# EAGLE schematic M6RF-315 (EAGLE 6.0)
DESIGNER: Sandor Szilvasi; PAGE1: Cover Page; PAGE2: M6-RF315; REVISION: A; TITLE: M6-RF315

## Sheet 1 of 2
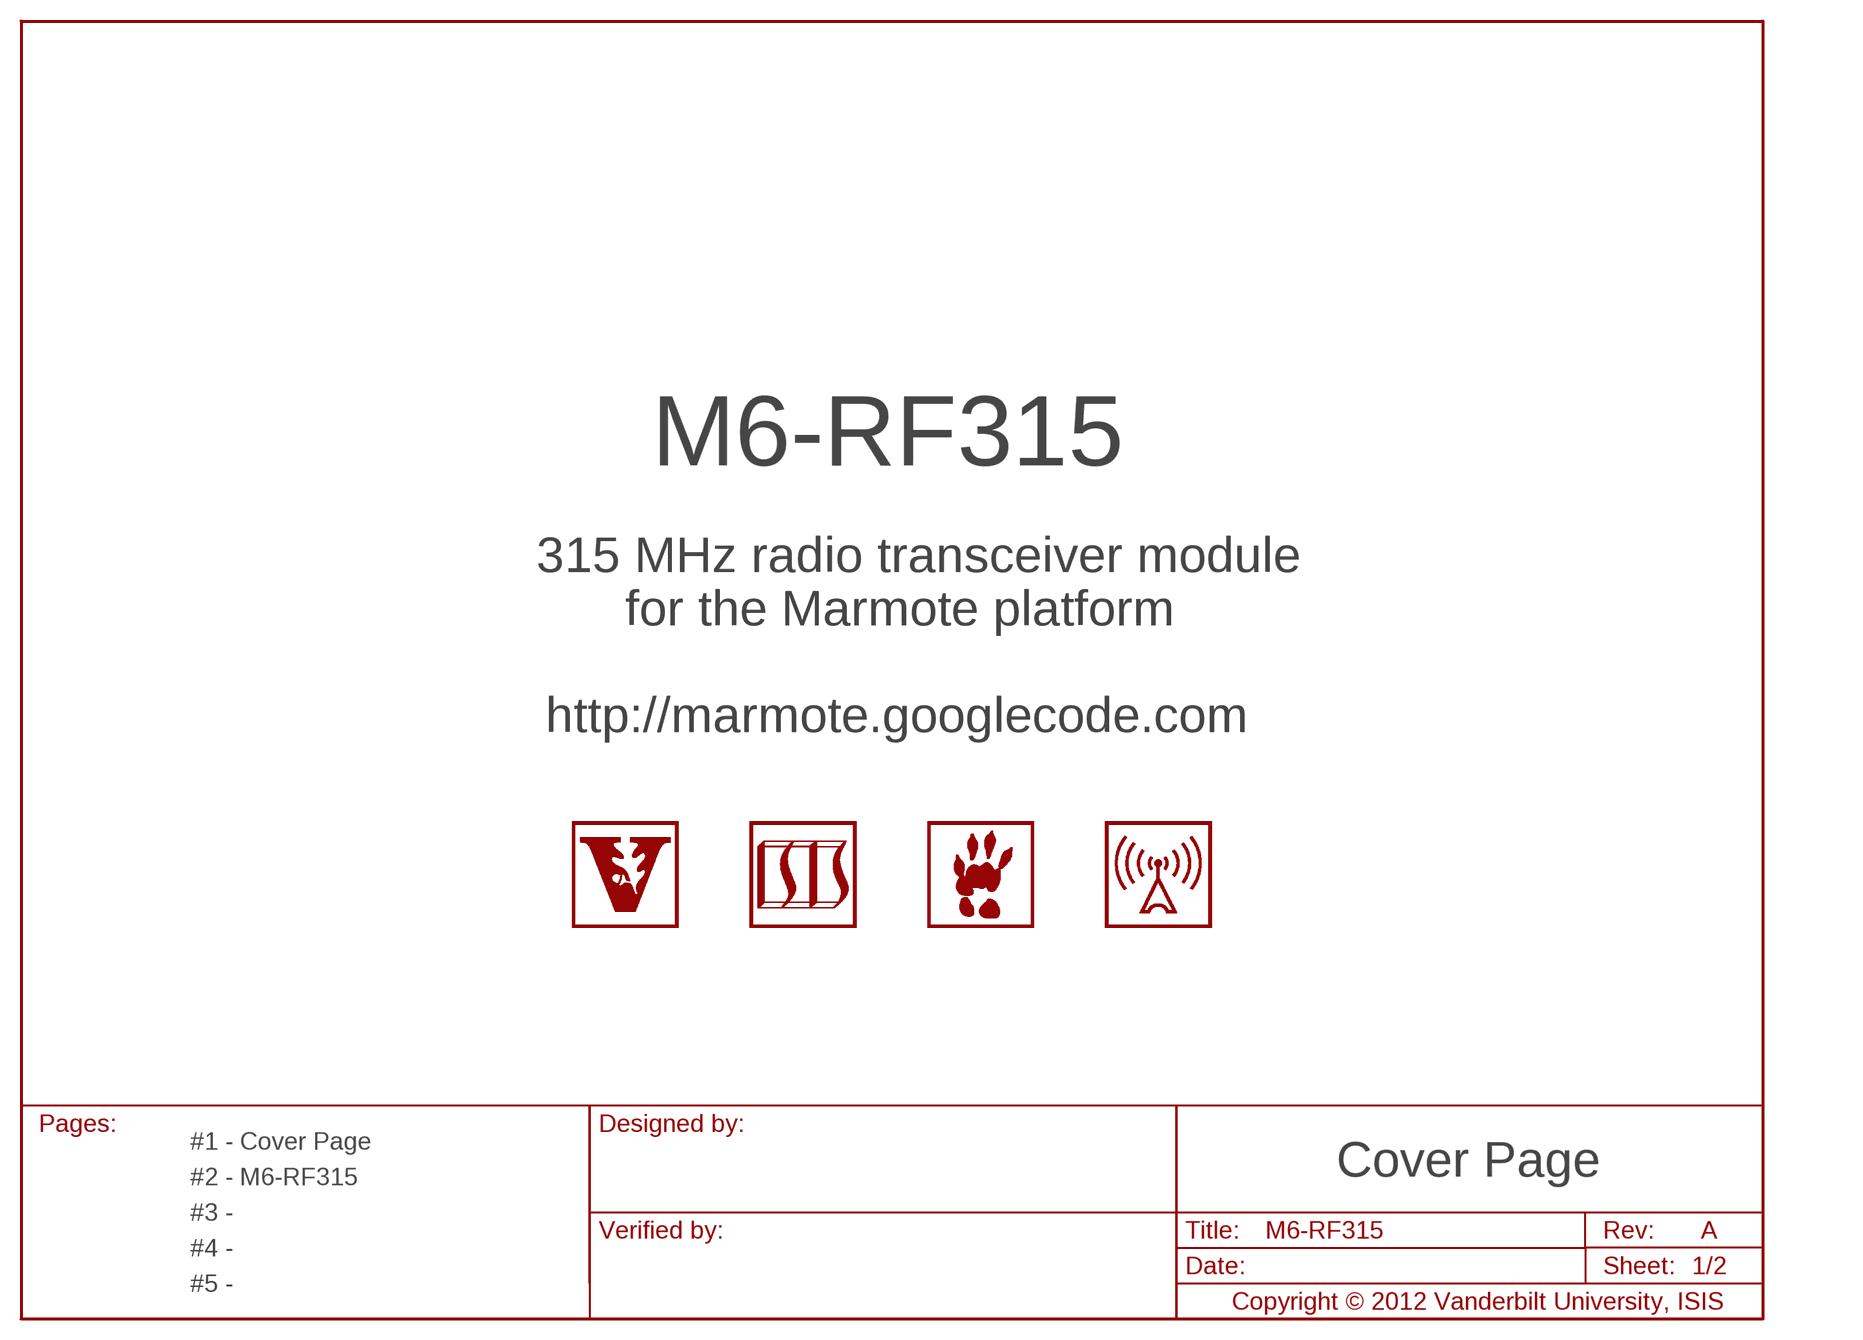
[diagram p0: schematic, sheet 1]

### Parts
LOGO1  LOGO-ISIS-600MIL-10MM-CU  [LOGO-ISIS-10MM-COPPER]
LOGO2  LOGO-MARMOTE-600MIL-10MM-CU  [LOGO-MARMOTE-10MM-COPPER]
LOGO3  LOGO-VANDERBILT-600MIL-10MM-CU  [LOGO-VANDERBILT-10MM-COPPER]
U$3  LOGO-RADIO-2-600MIL-10MM-CU  [LOGO-RADIO-2-10MM-COPPER]

### Notes on the sheet
- 315 MHz radio transceiver module
- for the Marmote platform
- http://marmote.googlecode.com

## Sheet 2 of 2
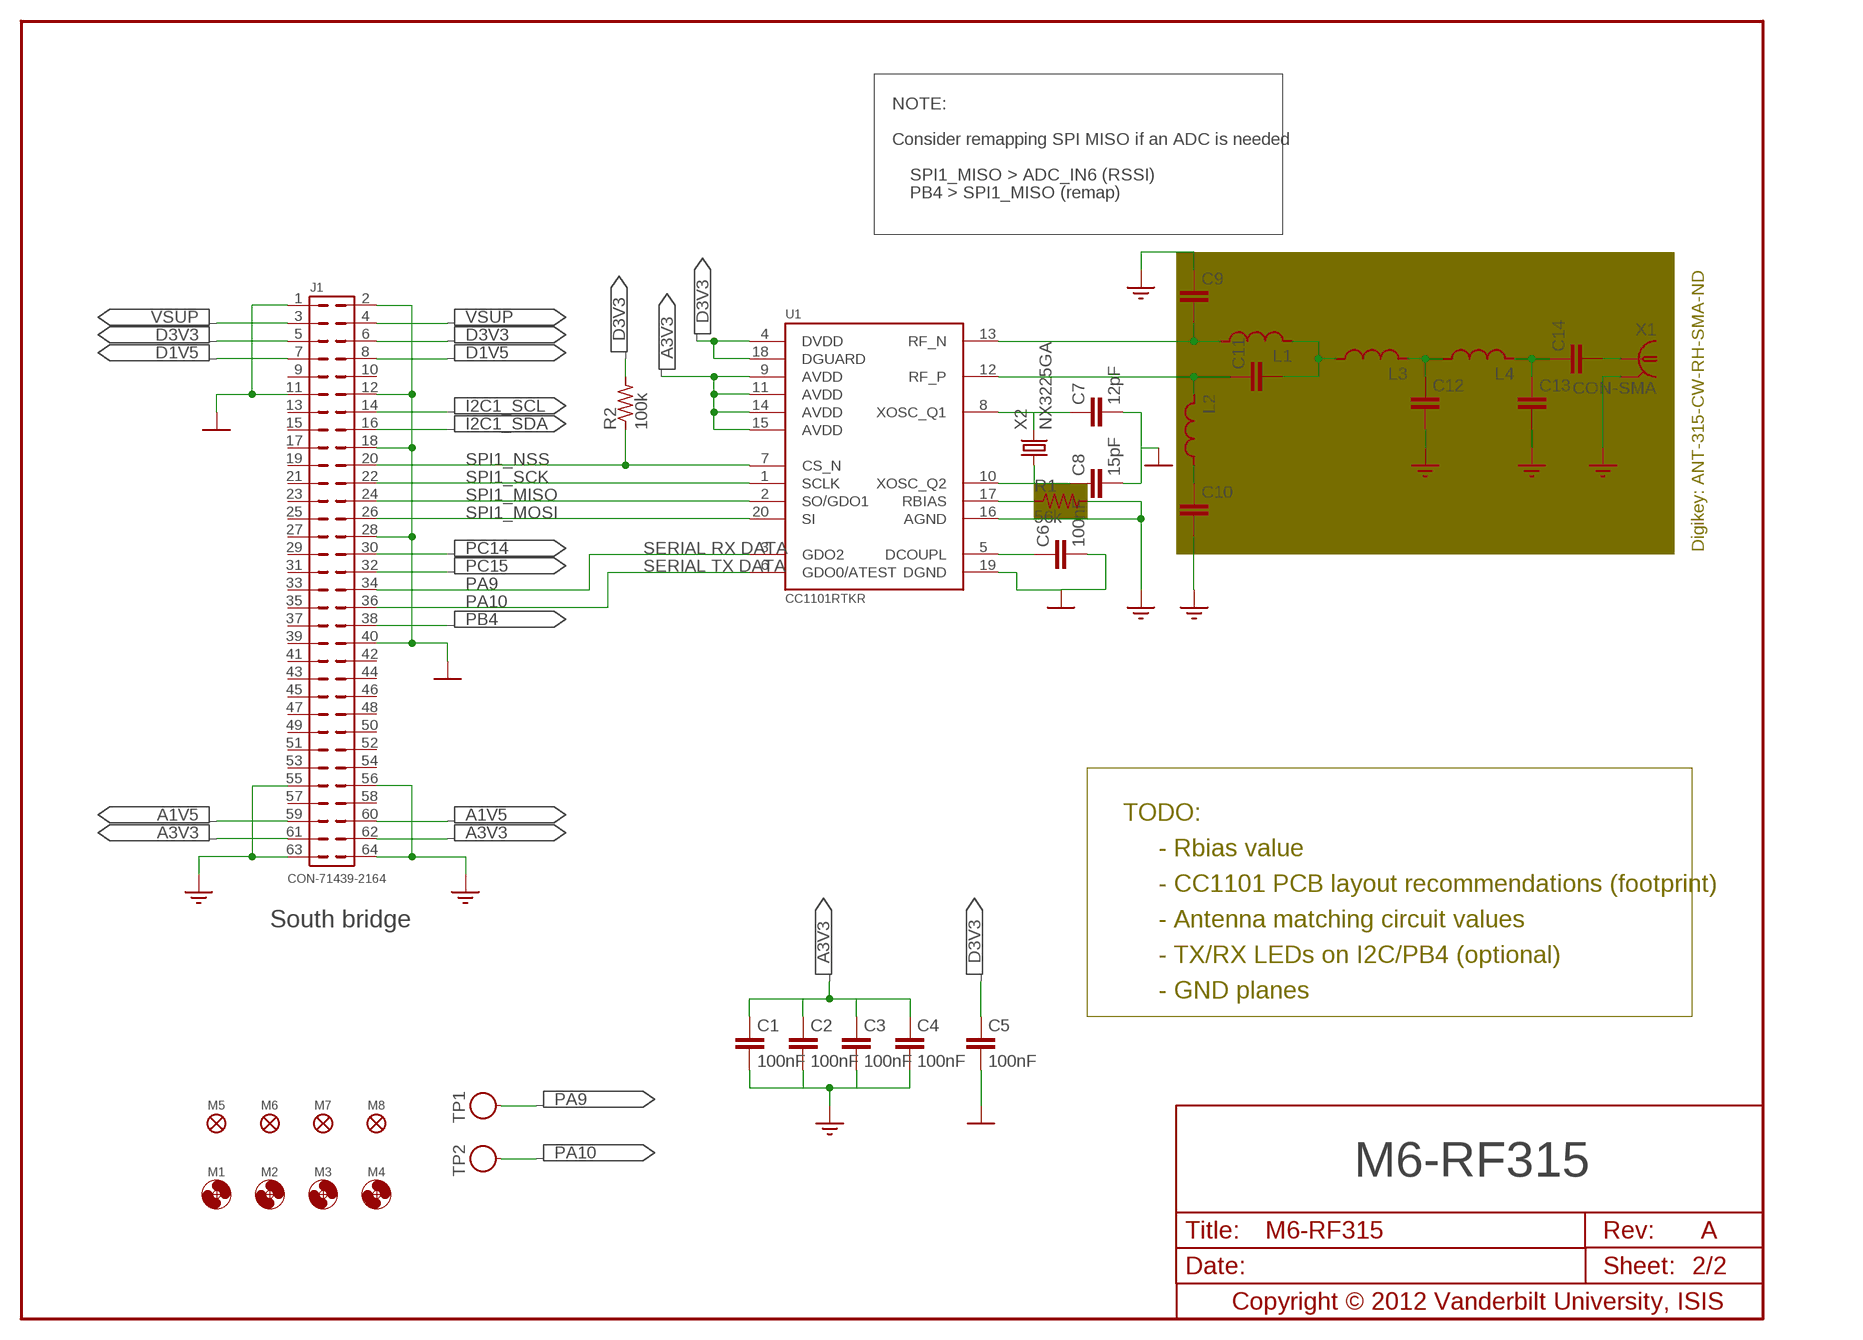
[diagram p1: schematic, sheet 2]

### Parts
C1  100nF  C0603  [C0603]
C2  100nF  C0603  [C0603]
C3  100nF  C0603  [C0603]
C4  100nF  C0603  [C0603]
C5  100nF  C0603  [C0603]
C6  100nF  C0603  [C0603]
C7  12pF  C0603  [C0603]
C8  15pF  C0603  [C0603]
C9  C0603  [C0603]
C10  C0603  [C0603]
C11  C0603  [C0603]
C12  C0603  [C0603]
C13  C0603  [C0603]
C14  C0603  [C0603]
J1  CON-71439-2164  [71439-XX64-BOT]
L1  L0603  [L0603]
L2  L0603  [L0603]
L3  L0603  [L0603]
L4  L0603  [L0603]
M1  MOUNT-HOLE3.3  [3,3]
M2  MOUNT-HOLE3.3  [3,3]
M3  MOUNT-HOLE3.3  [3,3]
M4  MOUNT-HOLE3.3  [3,3]
M5  FIDUCIAL1X2  [FIDUCIAL-1X2]
M6  FIDUCIAL1X2  [FIDUCIAL-1X2]
M7  FIDUCIAL1X2  [FIDUCIAL-1X2]
M8  FIDUCIAL1X2  [FIDUCIAL-1X2]
R1  56k  R0603  [R0603]
R2  100k  R0603  [R0603]
TP1  TESTPOINT-RED  [TESTPOINT]
TP2  TESTPOINT-RED  [TESTPOINT]
U1  CC1101RTKR  [QFN-20]
X1  CON-SMA  [LTI-SASF54GT]
X2  NX3225GA  [NX3225GA]

### Nets
A1V5: J1.59 J1.60
A3V3: C1.1 C2.1 C3.1 C4.1 J1.61 J1.62 U1.9(AVDD) U1.11(AVDD) U1.14(AVDD) U1.15(AVDD)
AGND: C1.2 C2.2 C3.2 C4.2 C9.1 C10.2 C12.2 C13.2 J1.55 J1.56 J1.63 J1.64 R1.2 U1.16(AGND) X1.2(GND)
D1V5: J1.7 J1.8
D3V3: C5.1 J1.5 J1.6 R2.2 U1.4(DVDD) U1.18(DGUARD)
DGND: C5.2 C7.2 C8.2 J1.1 J1.2 J1.11 J1.12 J1.18 J1.28 J1.40 U1.19(DGND)
I2C1_SCL: J1.14
I2C1_SDA: J1.16
N$1: J1.34 U1.3(GDO2)
N$2: C12.1 L3.2 L4.1
N$3: R1.1 U1.17(RBIAS)
N$4: C6.1 U1.5(DCOUPL)
N$5: C6.2
N$6: C8.1 U1.10(XOSC_Q2) X2.1
N$7: C7.1 U1.8(XOSC_Q1) X2.3
N$8: C11.1 L2.2 U1.12(RF_P)
N$9: C9.2 L1.1 U1.13(RF_N)
N$10: C11.2 L1.2 L3.1
N$11: C13.1 C14.1 L4.2
N$12: C14.2 X1.1
N$13: C10.1 L2.1
PA9: TP1.1 U1.6(GDO0/ATEST)
PA10: J1.36 TP2.1
PB4: J1.38
PC14: J1.30
PC15: J1.32
SPI1_MISO: J1.24 U1.2(SO/GDO1)
SPI1_MOSI: J1.26 U1.20(SI)
SPI1_NSS: J1.20 R2.1 U1.7(CS_N)
SPI1_SCK: J1.22 U1.1(SCLK)
VSUP: J1.3 J1.4
Unconnected: J1.9 J1.10 J1.13 J1.15 J1.17 J1.19 J1.21 J1.23 J1.25 J1.27 J1.29 J1.31 J1.33 J1.35 J1.37 J1.39 J1.41 J1.42 J1.43 J1.44 J1.45 J1.46 J1.47 J1.48 J1.49 J1.50 J1.51 J1.52 J1.53 J1.54 J1.57 J1.58 U1.E$1(AGND) U1.E$2(AGND) U1.E$3(AGND) U1.E$4(AGND)

### Notes on the sheet
- NOTE:
- Consider remapping SPI MISO if an ADC is needed
- SPI1_MISO > ADC_IN6 (RSSI)
- PB4 > SPI1_MISO (remap)
- Digikey: ANT-315-CW-RH-SMA-ND
- SERIAL RX DATA
- SERIAL TX DATA
- TODO:
- - Rbias value
- - CC1101 PCB layout recommendations (footprint)
- South bridge | - Antenna matching circuit values
- - TX/RX LEDs on I2C/PB4 (optional)
- - GND planes

## Power pins joined to a net without a drawn wire
DGND: X2.2(DGND) X2.4(DGND)
GND: X1.3(GND) X1.4(GND) X1.5(GND)

## Library data of the parts
C1-C14 = M6-RF315:C: CAPACITOR
J1 = M6-RF315:CON-71439: Board-to-Board Connector 1.00mm (.039") Mezzanine IEEE 1386 Receptacle - Dual Row 64-pin, SMT, Vertical Stacking Source: http://www.molex.com/molex/products/datasheet.jsp?part=active/0714392164_PCB_RECEPTACLES.xml&channel=Products; DIGI-KEY#: WM17222-ND; MATED-STACKING-HEIGHT: 13mm; MF: Molex; MPN: 71439-2164
L1-L4 = M6-RF315:L: INDUCTOR
LOGO1 = M6-RF315:LOGO-ISIS-600MIL: ISIS Logo Official logo of the Institute for Software Integrated Systems (ISIS), Vanderbilt as of 2011 Generated from 360 x 360 px bitmap and scaled to 600 x 600 mil v1.0 Initial design
LOGO2 = M6-RF315:LOGO-MARMOTE-600MIL: Marmote Platform Logo Preliminary logo for the Marmote Platform (http://marmote.googlecode.com) Generated from 360 x 360 px bitmap and scaled to 600 x 600 mil v1.1 Source bitmap smoothened v1.0 Initial design
LOGO3 = M6-RF315:LOGO-VANDERBILT-600MIL: Vanderbilt Logo Official Framed Vanderbilt Logo Generated from 360 x 360 px bitmap and scaled to 600 x 600 mil v1.1 Source bitmap smoothened v1.0 Initial design
M1-M4 = M6-RF315:MOUNT-HOLE: MOUNTING HOLE with drill center marker
M5-M8 = M6-RF315:FIDUCIAL: Fiducial Alignment Points Various fiducial points for machine vision alignment.
R1 R2 = M6-RF315:R: RESISTOR
TP1 TP2 = M6-RF315:TESTPOINT: Test Point Keystone compact through hole mount test point for SUPPLY and GROUND signals Terminal: .015 (.38) × .032 (.81) thick Phosphor Bronze Wire, Silver Plate Base: Nylon 46, UL Rated 94V-0 Mtg. Hole: .063 (1.6) Diameter Source: http://www.keyelco.com/pdfs/M55p51.pdf; DIGI-KEY#: 5005K-ND; MF: Keystone; MPN: 5005
U1 = M6-RF315:CC1101: CC1101 Texas Instruments CC1101 Radio Chip. Source: http://www.ti.com/lit/gpn/cc1101
U$3 = M6-RF315:LOGO-RADIO-2-600MIL: Radio Logo Preliminary logo for the Marmote platform analog radio front-end module. Generated from 360 x 360 px bitmap and scaled to 600 x 600 mil v1.0 Initial design
X1 = M6-RF315:CON-SMA: SMA vertical PCB thrue hole jack Source: Lighthorse Technologies, inc. SASF54GT.pdf; OC_FARNELL: unknown; OC_NEWARK: unknown
X2 = M6-RF315:NX3225GA: NX3225GA Crystal oscillator NDK NX3225GA small surface-mount type crystal unit in compact and thin 3.2 x 2.5 x 0.75 mm package. Source: http://www.ndk.com/images/products/catalog/c_NX3225GA-STD-CRG-1_e.pdf